# EasyEDA Pro project Git test.eprj

# Schematic Schematic1
Board Name: Board1; Create Date: 2025-01-23; Page Name: P1; Project Name: Git test; Schematic Name: Schematic1; Update Date: 2025-01-22; Company: EasyEDA.com; Page Size: A4; Version: V1.0
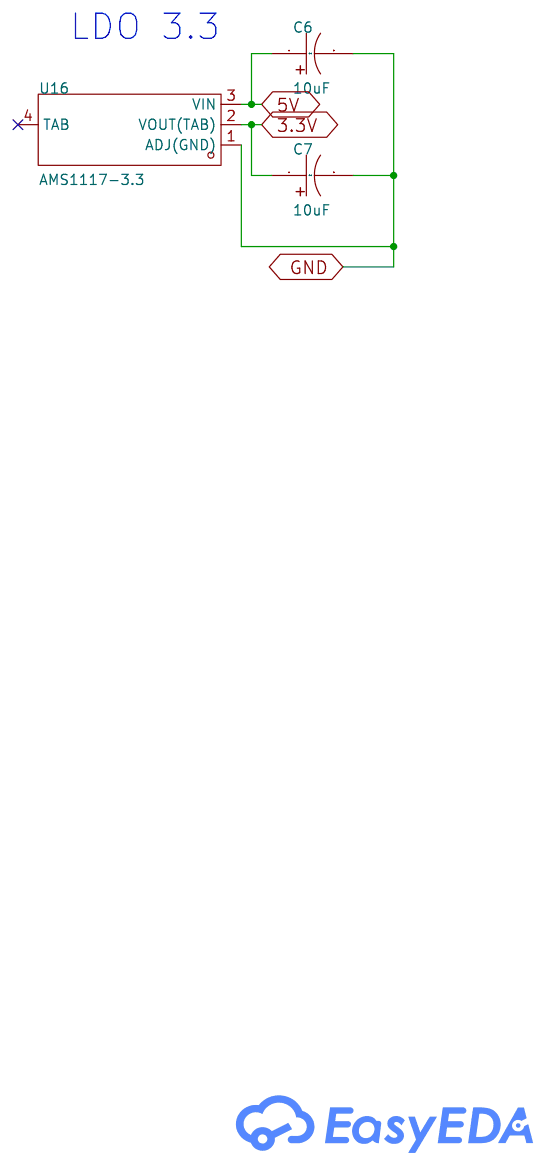
[diagram p0: schematic sheet]

## Parts
C6  10uF  [CAP-SMD_BD4.0-L4.3-W4.3-FD-LS5.1]
C7  10uF  [CAP-SMD_BD4.0-L4.3-W4.3-FD-LS5.1]
U16  AMS1117-3.3  [SOT-223-4_L6.5-W3.5-P2.30-LS7.0-BR]

## Library data of the parts
C6 C7 = VSS100M1CTR-0404: Capacitance: Tolerance:±20% Tolerance:±20% Rated Voltage: Ripple Current:- Equivalent Series Resistance(ESR):- φD: L: Lifetime @ Temp:2000hrs@85℃ Operating Temperature:-40℃~+85℃ Operating Temperature:-40℃~+85℃; LCSC Part Name: 10uF ±20% 16V; Supplier Part: C249787; Manufacturer: lelon(立隆); Supplier Footprint: SMD,D4xL4.5mm; JLCPCB Part Class: Extended Part; Datasheet: https://atta.szlcsc.com/upload/public/pdf/source/20181120/C249792_E78EF1C7C73E84F51169EB1D068529A5.pdf; Supplier: LCSC; Tolerance: ±20%; Lifetime @ Temp: 2000hrs@85℃; Operating Temperature: -40℃~+85℃
U16 = AMS1117-3.3_C347222: Output Type: Maximum Input Voltage:12V Output Voltage:3.3V Output Voltage:3.3V MAX Output Current:1A Power Supply Rejection Ratio (PSRR):60dB@(120Hz) Dropout Voltage:1.3V@(1A) standby current:- Noise:- Feature:- Operating Temperature:- Operating Temperatu; LCSC Part Name: 输出:3.3V 电流:1A 耐压:12V; Supplier Part: C347222; Manufacturer: UMW(友台半导体); Supplier Footprint: SOT-223; JLCPCB Part Class: Extended Part; Datasheet: https://atta.szlcsc.com/upload/public/pdf/source/20231109/155D79A26D9DB04352555A58D5969DC8.pdf; Supplier: LCSC; Maximum Input Voltage: 12V; Output Voltage: 3.3V; MAX Output Current: 1A; Power Supply Rejection Ratio (PSRR): 60dB@(120Hz); Dropout Voltage: 1.3V@(1A); Output Polarity: Positive electrode; Number of Outputs: 1

## Nets
3.3V: C7.1 U16.2(VOUT(TAB))
5V: C6.1 U16.3(VIN)
GND: C6.2 C7.2 U16.1(ADJ(GND))

Not connected (* = marked no-connect by the designer): U16 4(TAB)*

## Notes on the sheet
- LDO 3.3
